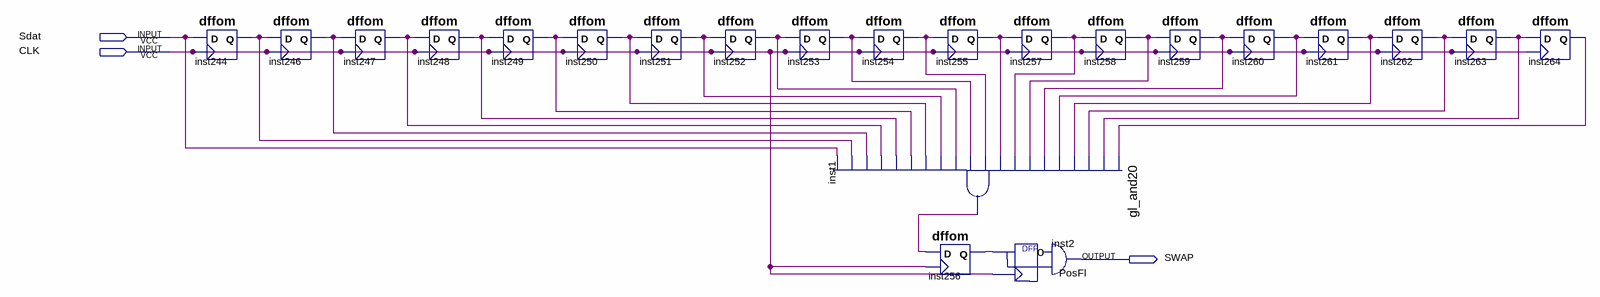
[diagram p0: schematic sheet]
// Quartus schematic FrameError.bdf as structural Verilog: 22 symbols, 3 pins
module FrameError (
  input  Sdat,
  input  CLK,
  output SWAP
);

  wire inst1_result, inst244_q, inst246_q, inst247_q, inst248_q, inst249_q, inst250_q, inst251_q, inst252_q,
       inst253_q, inst254_q, inst255_q, inst256_q, inst257_q, inst258_q, inst259_q, inst260_q, inst261_q,
       inst262_q, inst263_q, inst264_q;

  dffom inst244 (.D(Sdat), .CK(CLK), .Q(inst244_q));
  dffom inst246 (.D(inst244_q), .CK(CLK), .Q(inst246_q));
  dffom inst247 (.D(inst246_q), .CK(CLK), .Q(inst247_q));
  dffom inst248 (.D(inst247_q), .CK(CLK), .Q(inst248_q));
  dffom inst249 (.D(inst248_q), .CK(CLK), .Q(inst249_q));
  dffom inst250 (.D(inst249_q), .CK(CLK), .Q(inst250_q));
  dffom inst251 (.D(inst250_q), .CK(CLK), .Q(inst251_q));
  dffom inst252 (.D(inst251_q), .CK(CLK), .Q(inst252_q));
  dffom inst253 (.D(inst252_q), .CK(CLK), .Q(inst253_q));
  gl_and20 inst1 (
    .data0(inst264_q), .data1(inst263_q), .data2(inst262_q), .data3(inst261_q), .data4(inst260_q),
    .data5(inst259_q), .data6(inst258_q), .data7(inst257_q), .data8(inst255_q), .data9(inst254_q),
    .data10(inst253_q), .data11(inst252_q), .data12(inst251_q), .data13(inst250_q), .data14(inst249_q),
    .data15(inst248_q), .data16(inst247_q), .data17(inst246_q), .data18(inst244_q), .data19(Sdat),
    .result(inst1_result));
  dffom inst254 (.D(inst253_q), .CK(CLK), .Q(inst254_q));
  dffom inst255 (.D(inst254_q), .CK(CLK), .Q(inst255_q));
  dffom inst256 (.D(inst1_result), .CK(CLK), .Q(inst256_q));
  dffom inst257 (.D(inst255_q), .CK(CLK), .Q(inst257_q));
  PosFl inst2 (.CK(CLK), .IN(inst256_q), .OUT(SWAP));
  dffom inst258 (.D(inst257_q), .CK(CLK), .Q(inst258_q));
  dffom inst259 (.D(inst258_q), .CK(CLK), .Q(inst259_q));
  dffom inst260 (.D(inst259_q), .CK(CLK), .Q(inst260_q));
  dffom inst261 (.D(inst260_q), .CK(CLK), .Q(inst261_q));
  dffom inst262 (.D(inst261_q), .CK(CLK), .Q(inst262_q));
  dffom inst263 (.D(inst262_q), .CK(CLK), .Q(inst263_q));
  dffom inst264 (.D(inst263_q), .CK(CLK), .Q(inst264_q));
endmodule
